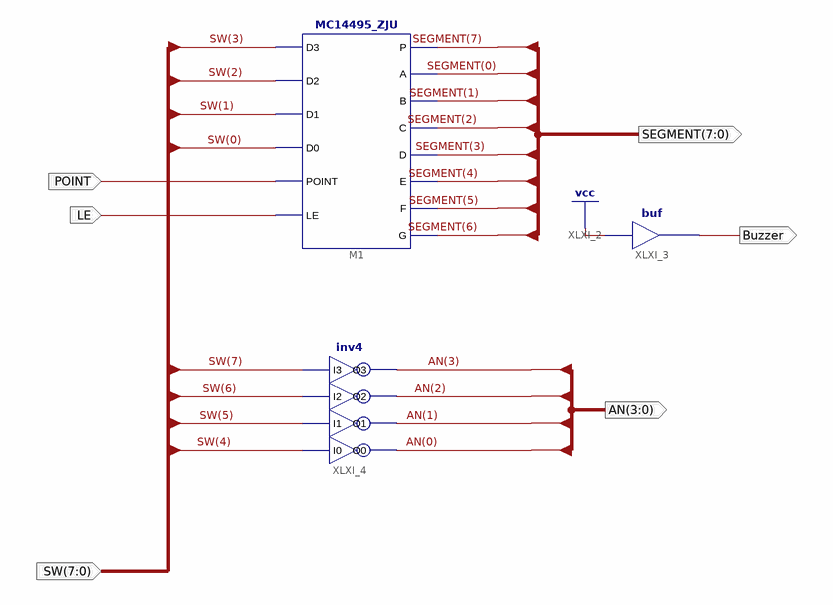
[diagram p0: schematic sheet 1]
// Xilinx ISE schematic Hex_27Seg_sch.sch (kintex7) as structural Verilog: 3 symbols, 6 ports
module Hex_27Seg_sch (
  input  [7:0] SW,
  input  POINT,
  input  LE,
  output [7:0] SEGMENT,
  output Buzzer,
  output [3:0] AN
);

  MC14495_ZJU M1 (
    .D3(SW[3]), .D2(SW[2]), .D1(SW[1]), .D0(SW[0]), .POINT(POINT), .LE(LE), .P(SEGMENT[7]), .A(SEGMENT[0]),
    .B(SEGMENT[1]), .C(SEGMENT[2]), .D(SEGMENT[3]), .E(SEGMENT[4]), .F(SEGMENT[5]), .G(SEGMENT[6]));
  buf XLXI_3 (Buzzer, 1'b1);
  inv4 XLXI_4 (.I0(SW[4]), .I1(SW[5]), .I2(SW[6]), .I3(SW[7]), .O0(AN[0]), .O1(AN[1]), .O2(AN[2]), .O3(AN[3]));
endmodule
